# EAGLE design JiaB (EAGLE 7.2.0)
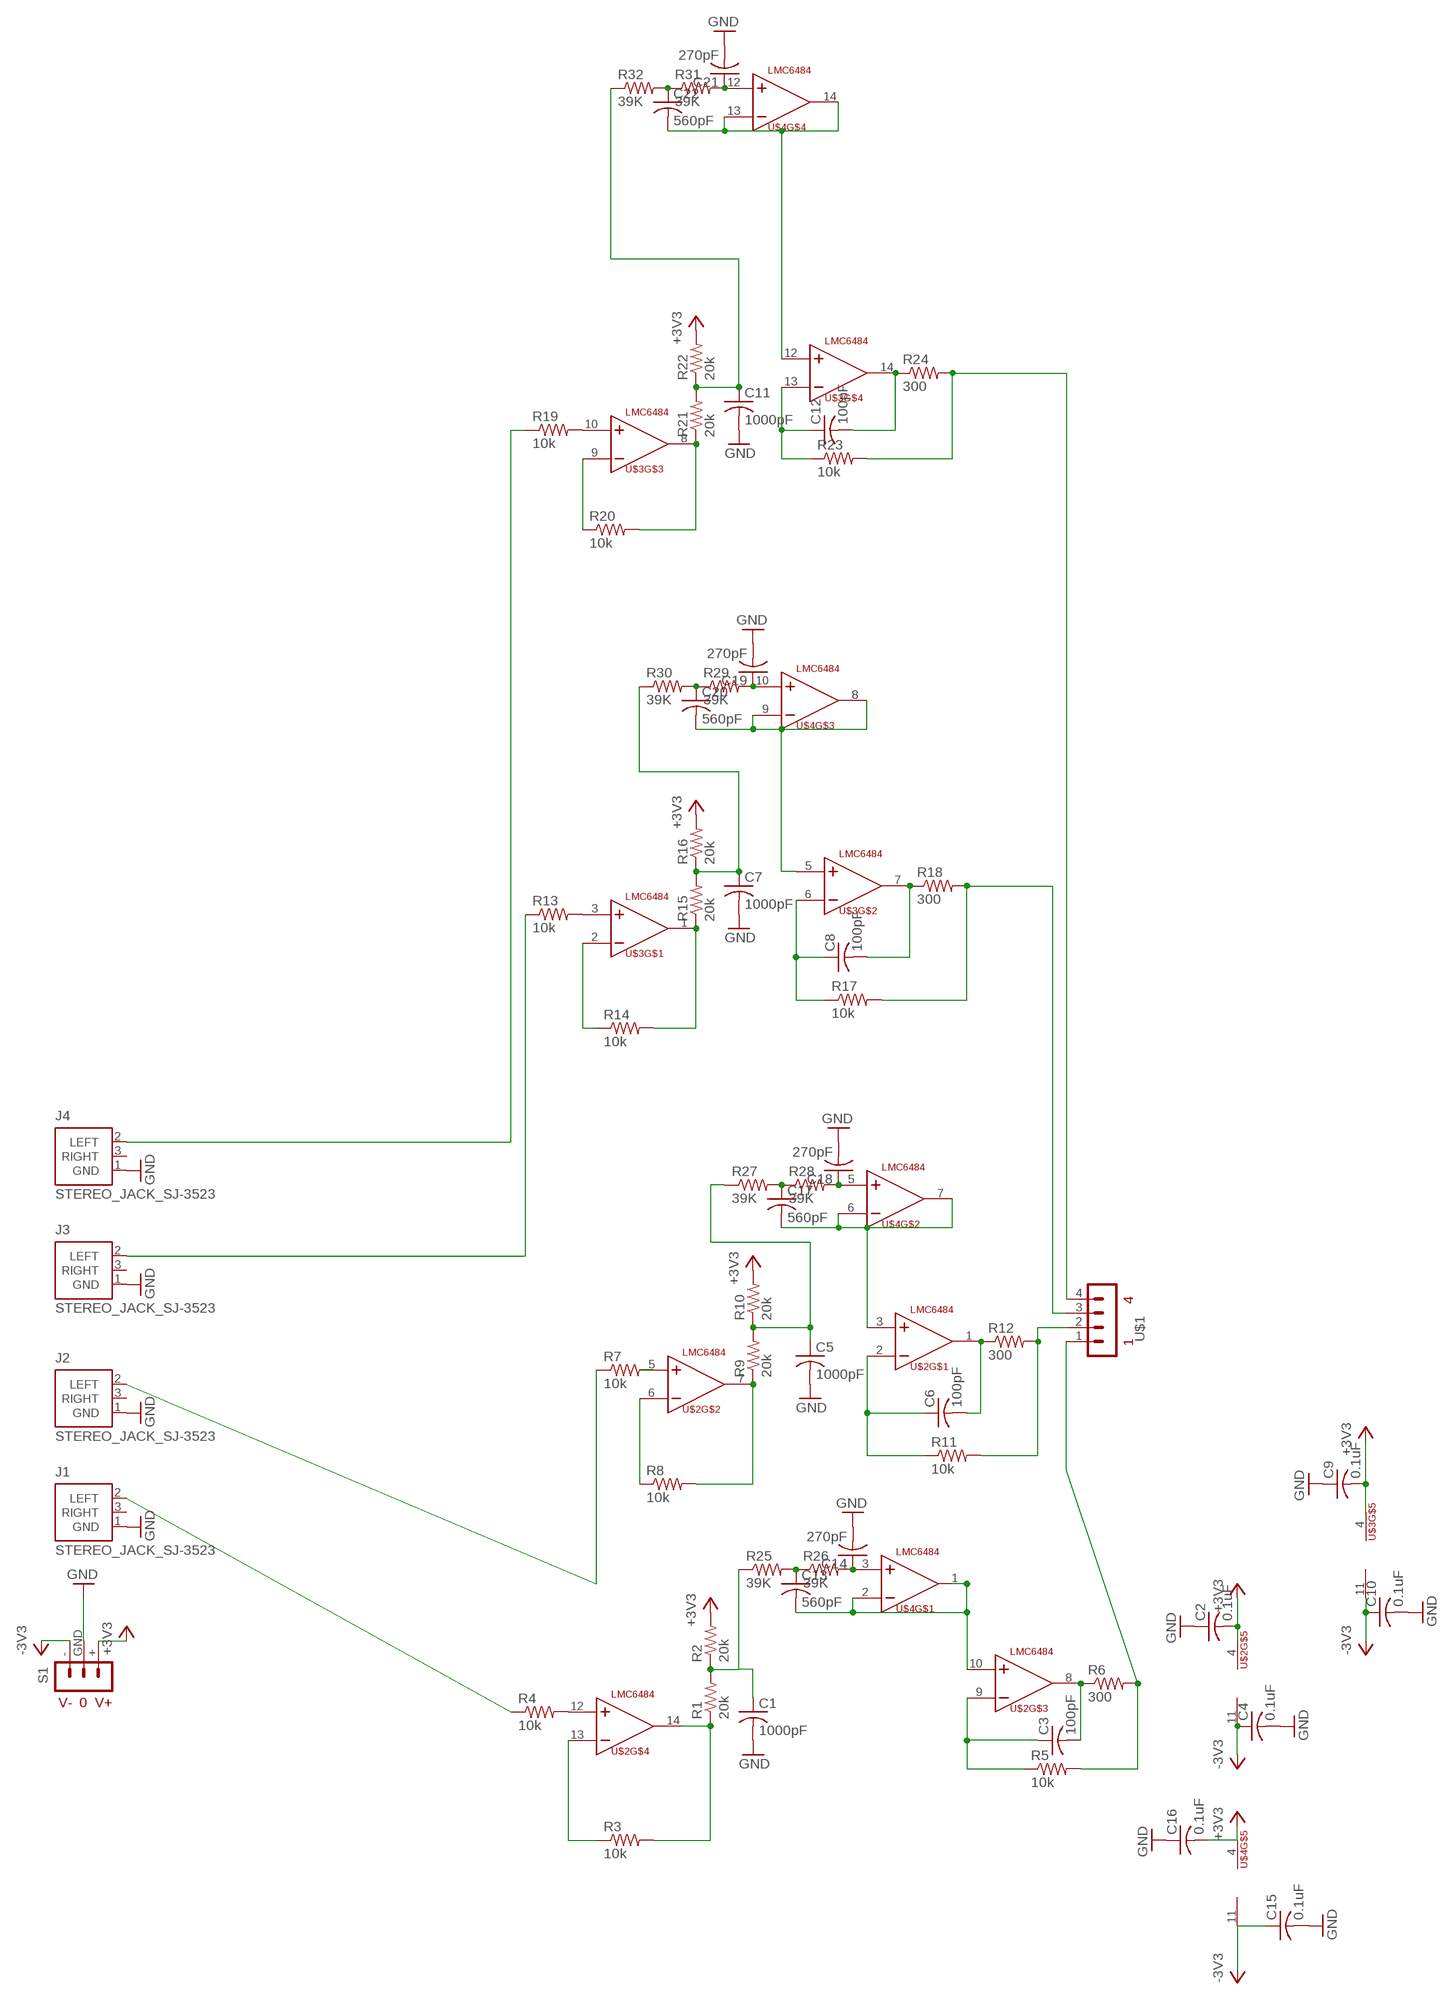
[diagram p0: schematic, sheet 1]

## Parts
C1  1000pF  C-US025-025X050  [C025-025X050]
C2  0.1uF  C-US025-025X050  [C025-025X050]
C3  100pF  C-US025-025X050  [C025-025X050]
C4  0.1uF  C-US025-025X050  [C025-025X050]
C5  1000pF  C-US025-025X050  [C025-025X050]
C6  100pF  C-US025-025X050  [C025-025X050]
C7  1000pF  C-US025-025X050  [C025-025X050]
C8  100pF  C-US025-025X050  [C025-025X050]
C9  0.1uF  C-US025-025X050  [C025-025X050]
C10  0.1uF  C-US025-025X050  [C025-025X050]
C11  1000pF  C-US025-025X050  [C025-025X050]
C12  100pF  C-US025-025X050  [C025-025X050]
C13  560pF  C-US025-025X050  [C025-025X050]
C14  270pF  C-US025-025X050  [C025-025X050]
C15  0.1uF  C-US025-025X050  [C025-025X050]
C16  0.1uF  C-US025-025X050  [C025-025X050]
C17  560pF  C-US025-025X050  [C025-025X050]
C18  270pF  C-US025-025X050  [C025-025X050]
C19  270pF  C-US025-025X050  [C025-025X050]
C20  560pF  C-US025-025X050  [C025-025X050]
C21  270pF  C-US025-025X050  [C025-025X050]
C22  560pF  C-US025-025X050  [C025-025X050]
J1  STEREO_JACK_SJ-3523  [SJ-3523]
J2  STEREO_JACK_SJ-3523  [SJ-3523]
J3  STEREO_JACK_SJ-3523  [SJ-3523]
J4  STEREO_JACK_SJ-3523  [SJ-3523]
R1  20k  R-US_0204/7  [0204/7]
R2  20k  R-US_0204/7  [0204/7]
R3  10k  R-US_0204/7  [0204/7]
R4  10k  R-US_0204/7  [0204/7]
R5  10k  R-US_0204/7  [0204/7]
R6  300  R-US_0204/7  [0204/7]
R7  10k  R-US_0204/7  [0204/7]
R8  10k  R-US_0204/7  [0204/7]
R9  20k  R-US_0204/7  [0204/7]
R10  20k  R-US_0204/7  [0204/7]
R11  10k  R-US_0204/7  [0204/7]
R12  300  R-US_0204/7  [0204/7]
R13  10k  R-US_0204/7  [0204/7]
R14  10k  R-US_0204/7  [0204/7]
R15  20k  R-US_0204/7  [0204/7]
R16  20k  R-US_0204/7  [0204/7]
R17  10k  R-US_0204/7  [0204/7]
R18  300  R-US_0204/7  [0204/7]
R19  10k  R-US_0204/7  [0204/7]
R20  10k  R-US_0204/7  [0204/7]
R21  20k  R-US_0204/7  [0204/7]
R22  20k  R-US_0204/7  [0204/7]
R23  10k  R-US_0204/7  [0204/7]
R24  300  R-US_0204/7  [0204/7]
R25  39K  R-US_0204/7  [0204/7]
R26  39K  R-US_0204/7  [0204/7]
R27  39K  R-US_0204/7  [0204/7]
R28  39K  R-US_0204/7  [0204/7]
R29  39K  R-US_0204/7  [0204/7]
R30  39K  R-US_0204/7  [0204/7]
R31  39K  R-US_0204/7  [0204/7]
R32  39K  R-US_0204/7  [0204/7]
S1  TERMINAL_BLOCK_3_+/-3.3V  [TERMINAL_BLOCK_3.5MM_3]
U$1  TERMINAL-BLOCK-4  [TERMINAL-BLOCK-4]
U$2  LMC6484  [DIL14]
U$3  LMC6484  [DIL14]
U$4  LMC6484  [DIL14]

## Nets
+3V3: C2.2 C9.2 C16.2 R2.2 R10.2 R16.2 R22.2 S1.+ U$2.4(VCC+) U$3.4(VCC+) U$4.4(VCC+)
-3V3: C4.1 C10.1 C15.1 S1.- U$2.11(VCC-) U$3.11(VCC-) U$4.11(VCC-)
GND: C1.2 C2.1 C4.2 C5.2 C7.2 C9.1 C10.2 C11.2 C14.2 C15.2 C16.1 C18.2 C19.2 C21.2 J1.1(GND) J2.1(GND) J3.1(GND) J4.1(GND) S1.GND
N$1: J1.2(LEFT) R4.1
N$2: J2.2(LEFT) R7.1
N$3: J3.2(LEFT) R13.1
N$4: J4.2(LEFT) R19.1
N$5: R1.1 R3.2 U$2.14(OUT)
N$6: C1.1 R1.2 R2.1 R25.1
N$7: R4.2 U$2.12(IN+)
N$8: C3.2 R6.1 U$2.8(OUT)
N$9: R3.1 U$2.13(IN-)
N$10: R7.2 U$2.5(IN+)
N$11: R5.2 R6.2 U$1.1
N$12: R8.2 R9.1 U$2.7(OUT)
N$13: C3.1 R5.1 U$2.9(IN-)
N$14: C5.1 R9.2 R10.1 R27.1
N$15: C6.2 R12.1 U$2.1(OUT)
N$16: R8.1 U$2.6(IN-)
N$17: C6.1 R11.1 U$2.2(IN-)
N$18: R11.2 R12.2 U$1.2
N$19: R13.2 U$3.3(IN+)
N$20: R14.2 R15.1 U$3.1(OUT)
N$21: C7.1 R15.2 R16.1 R30.1
N$22: C8.2 R18.1 U$3.7(OUT)
N$23: R14.1 U$3.2(IN-)
N$24: C8.1 R17.1 U$3.6(IN-)
N$25: R17.2 R18.2 U$1.3
N$26: R19.2 U$3.10(IN+)
N$27: R20.2 R21.1 U$3.8(OUT)
N$28: C11.1 R21.2 R22.1 R32.1
N$29: C12.2 R24.1 U$3.14(OUT)
N$30: R20.1 U$3.9(IN-)
N$31: C12.1 R23.1 U$3.13(IN-)
N$32: R23.2 R24.2 U$1.4
N$33: C14.1 R26.2 U$4.3(IN+)
N$34: C13.2 U$2.10(IN+) U$4.1(OUT) U$4.2(IN-)
N$35: C18.1 R28.2 U$4.5(IN+)
N$36: C13.1 R25.2 R26.1
N$37: C17.1 R27.2 R28.1
N$38: C17.2 U$2.3(IN+) U$4.6(IN-) U$4.7(OUT)
N$39: C19.1 R29.2 U$4.10(IN+)
N$40: C20.1 R29.1 R30.2
N$41: C20.2 U$3.5(IN+) U$4.8(OUT) U$4.9(IN-)
N$42: C21.1 R31.2 U$4.12(IN+)
N$43: C22.1 R31.1 R32.2
N$44: C22.2 U$3.12(IN+) U$4.13(IN-) U$4.14(OUT)
Unconnected: J1.3(RIGHT) J2.3(RIGHT) J3.3(RIGHT) J4.3(RIGHT)

## Library data of the parts
C1-C12 C15 C16 = resistor:C-US: CAPACITOR, American symbol
C13 C14 C17-C22 = rcl:C-US: CAPACITOR, American symbol
J1-J4 = RHD2000_eval_board:STEREO_JACK: CUI Inc. SJ-3523 stereo audio jack
R1-R24 = resistor:R-US_: RESISTOR, American symbol
R25-R32 = rcl:R-US_: RESISTOR, American symbol
S1 = RHD2000_eval_board:TERMINAL_BLOCK_3: 3-point terminal block
U$1 = kjbrown:TERMINAL-BLOCK-4
U$2-U$4 = kjbrown:LMC6484: texas instruments quad channel op amp LMC6484

## Board
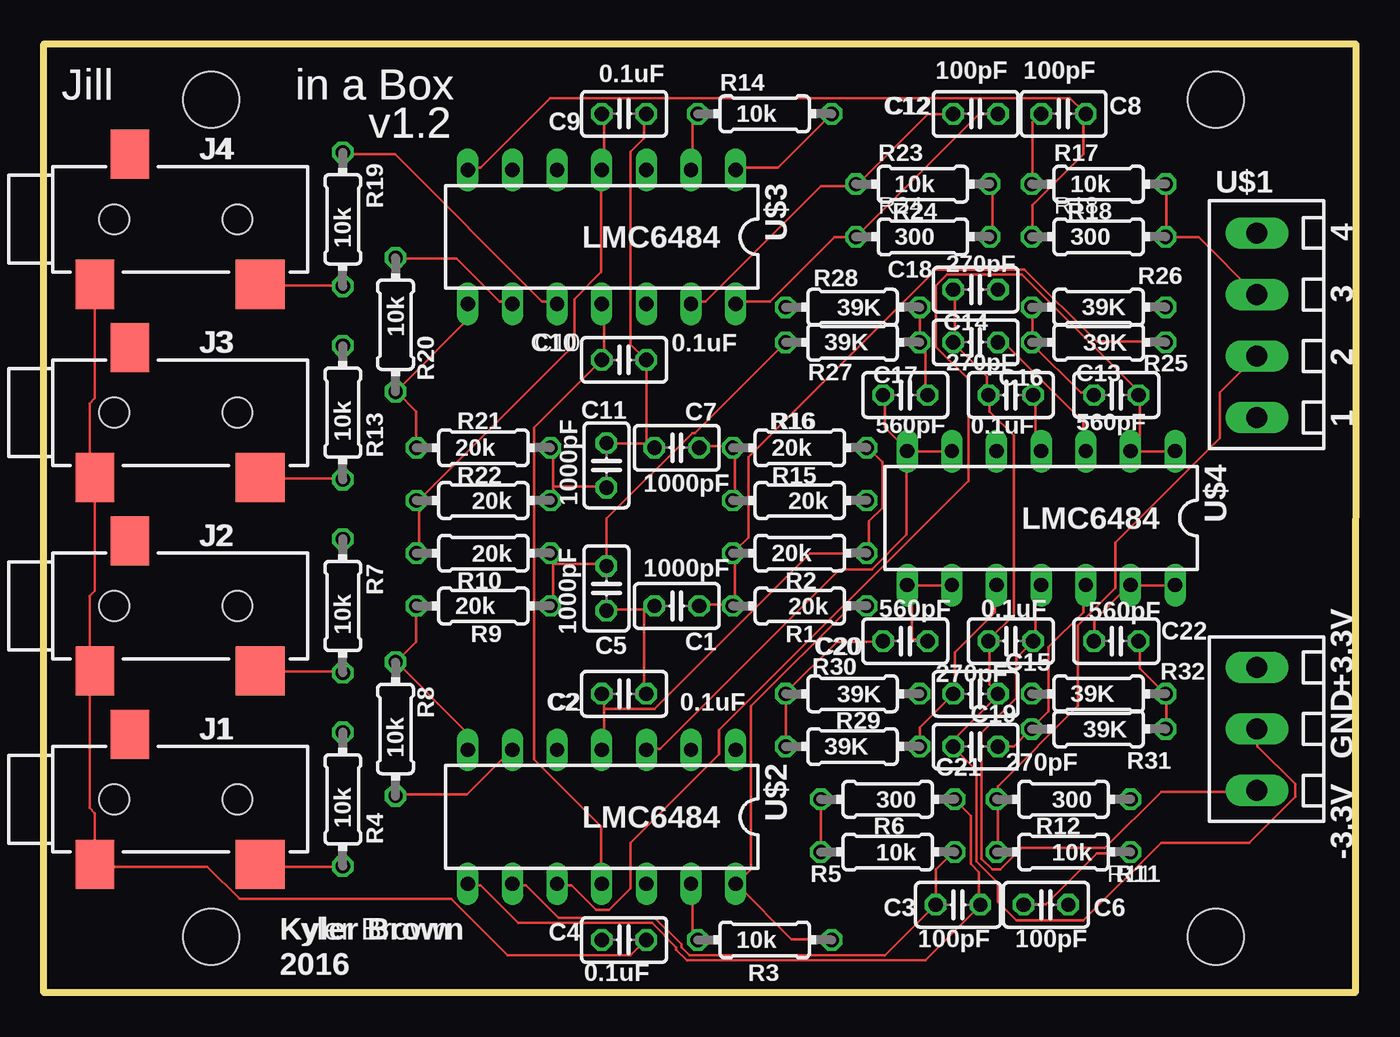
[diagram p1: board, top side]
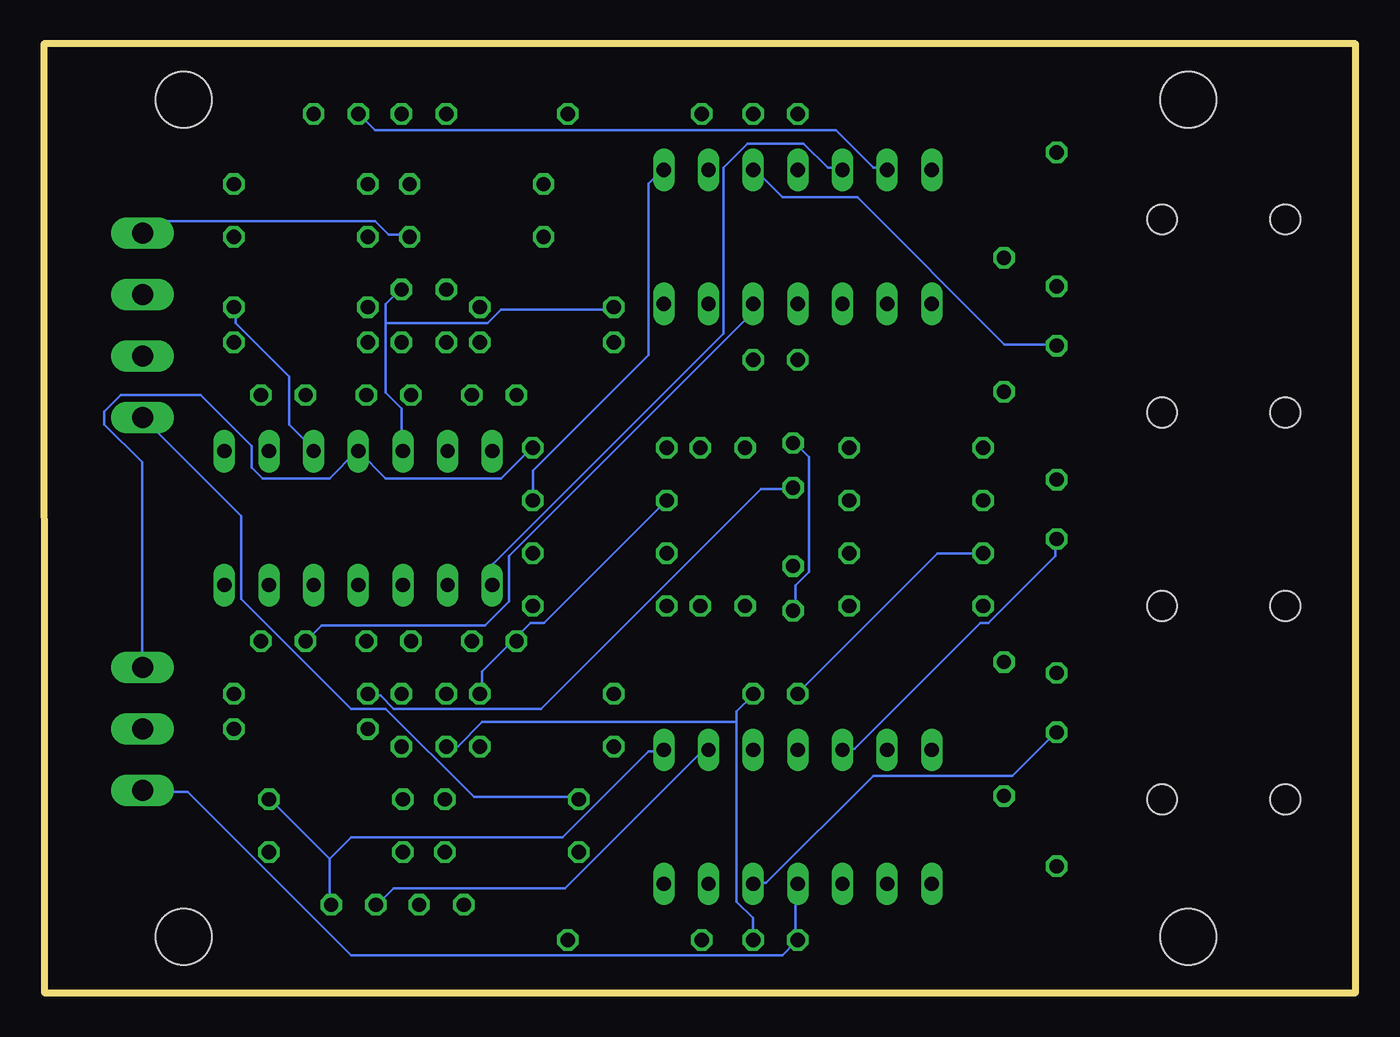
[diagram p2: board, bottom side, seen from below]

Size 74.61 x 53.98 mm. Coordinates in mm from the lower left corner, seen from the top.
Outline: 0,0 0,53.98 74.61,53.98 74.59,0 0,0
Copper layers (1*16): Top 0.0356mm / dielectric 1.5011mm / Bottom 0.0356mm
Design rules "LaenPCBOrder": minimum track width 6mil, minimum drill 13mil, track to track 6mil, track to pad 6mil, pad to pad 6mil, via to via 6mil, smd to smd 6mil, copper to edge 15mil, drill to drill 6mil, minimum pad ring 7mil, minimum via ring 7mil, stop-mask expansion 3mil, vias tented up to drill 0mil, thermal gap 10mil
Holes 3.2 mm at 9.53,3.17 9.53,50.8 66.67,50.8 66.67,3.17

### Footprints (pad centres in the part's own frame; a part is rotated, then mirrored left to right if it is on the bottom)
C025-025X050 = drill 0.813 octagon: 1 -1.27,0; 2 1.27,0
SJ-3523 = smd 2.2 x 2.8: 1 -1.1,-3.7; 3 0.9,3.7 | smd 2.8 x 2.8: 2 8.3,-3.7 | hole 1.7: 7,0; 0,0
0204/7 = drill 0.813 octagon: 1 -3.81,0; 2 3.81,0
TERMINAL_BLOCK_3.5MM_3 = drill 1.2 long: + 3.5,0; - -3.5,0; GND 0,0
TERMINAL-BLOCK-4 = drill 1.2 long: 1 -12.28,0; 2 -8.78,0; 3 -5.28,0; 4 -1.78,0
DIL14 = drill 0.813 long: 1 -6.35,-3.81; 2 -3.81,-3.81; 3 -1.27,-3.81; 4 1.27,-3.81; 5 3.81,-3.81; 6 6.35,-3.81; 7 8.89,-3.81; 8 8.89,3.81; 9 6.35,3.81; 10 3.81,3.81; 11 1.27,3.81; 12 -1.27,3.81; 13 -3.81,3.81; 14 -6.35,3.81

### Placement (x,y rotation side)
C1  36,22 180 top
C2  33,17 180 top
C3  52,5 0 top
C4  33,3 0 top
C5  32,23 270 top
C6  57,5 0 top
C7  36,31 180 top
C8  58,50 0 top
C9  33,50 180 top
C10  33,36 0 top
C11  32,30 90 top
C12  53,50 0 top
C13  61,34 0 top
C14  53,37 180 top
C15  55,20 180 top
C16  55,34 0 top
C17  49,34 180 top
C18  53,40 180 top
C19  53,17 0 top
C20  49,20 0 top
C21  53,14 180 top
C22  61,20 180 top
J1  4,11 0 top
J2  4,22 0 top
J3  4,33 0 top
J4  4,44 0 top
R1  43,22 180 top
R2  43,25 0 top
R3  41,3 0 top
R4  17,11 90 top
R5  48,8 180 top
R6  48,11 180 top
R7  17,22 90 top
R8  20,15 90 top
R9  25,22 0 top
R10  25,25 180 top
R11  58,8 180 top
R12  58,11 180 top
R13  17,33 90 top
R14  41,50 0 top
R15  43,28 180 top
R16  43,31 0 top
R17  60,46 0 top
R18  60,43 0 top
R19  17,44 90 top
R20  20,38 270 top
R21  25,31 0 top
R22  25,28 180 top
R23  50,46 0 top
R24  50,43 0 top
R25  60,37 180 top
R26  60,39 0 top
R27  46,37 0 top
R28  46,39 180 top
R29  46,14 0 top
R30  46,17 180 top
R31  60,15 180 top
R32  60,17 0 top
S1  69,15 90 top
U$1  69,45 90 top
U$2  33,10 180 top
U$3  33,43 180 top
U$4  58,27 180 top

### Tracks (layer width: path | path; a pad name or v marks a point on that pad's centre or on a via)
+3V3
  Top 0.152: R16.2 46.94,30.94 47.7,30.18 47.7,27.58 46.94,26.82 46.94,25.15 R2.2 46.79,24.99 43.59,24.99 34.75,16.15 31.85,16.15 | C16.2 56.39,33.98 56.39,31.24 56.69,30.94 U$4.4 | C9.2 31.85,49.99 31.85,46.94 U$3.4 31.7,46.79 31.7,41 30.18,39.47 30.18,36.88 21.34,28.04 R22.2 21.34,27.89 21.34,25.15 R10.2 | 31.85,16.15 31.85,16.92 C2.2 | 31.85,16.15 31.85,13.87 U$2.4
  Bottom 0.152: S1.+ 69.04,18.59 69.04,30.18 71.17,32.31 71.17,33.07 70.26,33.98 65.68,33.98 62.79,31.09 62.79,29.87 62.18,29.26 58.37,29.26 56.84,30.79 U$4.4 56.69,30.79 55.17,29.26 48.62,29.26 46.94,30.94 R16.2 | R10.2 21.34,24.99 23.77,24.99 31.7,17.07 C2.2
-3V3
  Top 0.152: U$4.11 56.69,23.16 56.39,22.86 56.39,20.12 C15.1 56.24,19.96 55.32,19.05 55.32,16.76 53.34,14.78 53.34,7.62 53.95,7.01 54.41,7.01 55.63,8.23 60.35,8.23 63.55,11.43 68.89,11.43 S1.- | U$3.11 31.85,39.17 31.85,36.12 C10.1 31.7,35.97 27.89,32.16 27.89,13.26 31.7,9.45 31.7,6.25 U$2.11
  Bottom 0.152: U$2.11 31.85,6.1 31.85,3.05 C4.1 31.85,2.9 32.61,2.13 57.15,2.13 66.45,11.43 68.89,11.43 S1.-
GND
  Top 0.152: C18.2 51.82,39.93 51.82,37.03 C14.2 51.82,36.88 53.65,35.05 53.65,34.14 C16.1 53.8,33.98 53.8,33.07 55.17,31.7 55.17,21.49 53.8,20.12 C15.2 53.8,19.96 53.8,17.53 54.25,17.07 C19.2 54.25,16.92 51.82,14.48 51.82,14.02 C21.2 51.82,13.87 53.03,12.65 53.03,7.47 54.25,6.25 54.25,5.18 55.32,4.12 59.13,4.12 63.55,8.53 68.58,8.53 71.17,11.12 71.17,11.89 69.04,14.02 69.04,14.94 S1.GND | J4.1 2.9,40.23 2.9,33.83 2.59,33.53 2.59,29.72 2.9,29.41 J3.1 2.9,29.26 2.9,22.86 2.59,22.55 2.59,18.75 2.9,18.44 J2.1 2.9,18.29 2.59,17.98 2.59,10.52 2.9,10.21 2.9,7.32 J1.1 3.05,7.16 9.3,7.16 11.12,5.33 23.16,5.33 26.36,2.13 33.38,2.13 34.14,2.9 C4.2 | 34.14,21.79 34.44,21.79 34.59,21.95 C1.2 34.14,21.79 | 34.14,21.79 32,21.79 C5.2 | 34.14,21.79 34.14,17.07 C2.1 | 34.29,31.24 34.44,31.24 34.59,31.09 C7.2 34.29,31.24 | 34.29,31.24 32,31.24 C11.2 | 34.29,31.24 34.29,35.97 C10.2 34.14,36.12 33.38,36.88 33.38,47.85 34.14,48.62 34.14,49.99 C9.1
  Bottom 0.152: 35.2,15.39 35.2,16 34.29,16.92 C2.1 | 35.2,15.39 35.2,5.18 34.29,4.27 34.29,3.05 C4.2 | C5.2 31.85,21.79 31.85,23.16 31.09,23.93 31.09,30.48 31.85,31.24 C11.2 | 35.2,15.39 49.68,15.39 51.05,14.02 51.66,14.02 C21.2
N$1
  Top 0.152: R4.1 16.92,7.16 12.34,7.16 J1.2
N$2
  Top 0.152: R7.1 16.92,18.29 12.34,18.29 J2.2
N$3
  Top 0.152: R13.1 16.92,29.26 12.34,29.26 J3.2
N$4
  Top 0.152: R19.1 16.92,40.23 12.34,40.23 J4.2
N$5
  Top 0.152: R3.2 44.81,3.05 42.52,3.05 39.47,6.1 U$2.14 39.47,6.25 40.23,7.01 40.23,16.31 45.87,21.95 46.79,21.95 R1.1
N$6
  Top 0.152: C1.1 37.34,22.1 39.17,22.1 R1.2 39.32,22.1 39.32,24.99 R2.1 39.32,25.15 40.08,25.91 40.08,30.48 50.75,41.15 55.78,41.15 59.89,37.03 63.7,37.03 R25.1
N$7
  Bottom 0.152: U$2.12 34.14,6.25 33.53,6.25 27.43,12.34 19.51,12.34 17.07,14.78 R4.2
N$8
  Top 0.152: R6.1 51.82,10.97 52.73,10.06 52.73,7.32 53.19,6.86 53.19,5.03 C3.2 53.19,4.88 50.14,1.83 36.58,1.83 35.97,2.44 35.97,2.59 34.59,3.96 26.98,3.96 24.84,6.1 24.23,6.1 U$2.8
N$9
  Top 0.152: U$2.13 36.88,6.1 36.88,3.35 37.19,3.05 R3.1
N$10
  Bottom 0.152: U$2.5 29.11,13.87 28.5,13.87 21.34,21.03 20.88,21.03 17.07,24.84 17.07,25.76 R7.2
N$11
  Top 0.152: R5.2 44.2,8.08 44.2,10.97 R6.2
  Bottom 0.152: R6.2 44.2,11.12 50.14,11.12 55.17,16.15 57.15,16.15 63.4,22.4 63.4,27.13 68.89,32.61 U$1.1
N$12
  Top 0.152: U$2.7 24.08,13.87 24.08,14.78 20.12,18.75 R8.2 20.12,18.9 21.18,19.96 21.18,21.95 R9.1
N$13
  Top 0.152: R5.1 51.66,7.92 50.75,7.01 50.75,5.03 C3.1 50.6,4.88 47.85,2.13 36.73,2.13 36.27,2.59 36.27,2.74 34.75,4.27 29.26,4.27 27.43,6.1 26.67,6.1 U$2.9
N$14
  Top 0.152: 28.96,24.38 28.96,24.99 R10.1 | 28.96,24.38 28.96,22.1 R9.2 | 28.96,24.38 31.85,24.38 C5.1 32,24.38 32,26.98 36.88,31.85 37.03,31.85 42.06,36.88 R27.1
N$15
  Bottom 0.152: 58.37,7.62 58.37,5.03 C6.2 | 58.37,7.62 61.72,10.97 R12.1 | 58.37,7.62 57.15,8.84 45.11,8.84 40.23,13.72 39.47,13.72 U$2.1
N$16
  Top 0.152: R8.1 20.12,11.28 24.08,11.28 26.52,13.72 U$2.6
N$17
  Top 0.152: C6.1 55.78,5.03 57,5.03 59.89,7.92 61.72,7.92 R11.1
  Bottom 0.152: U$2.2 36.88,13.72 37.19,13.72 44.96,5.94 54.71,5.94 55.63,5.03 C6.1
N$18
  Top 0.152: R11.2 54.25,8.08 54.25,10.97 R12.2 54.25,11.12 54.25,11.73 58.83,16.31 58.83,20.88 60.96,23.01 60.96,25.6 66.9,31.55 66.9,34.14 68.89,36.12 U$1.2
N$19
  Bottom 0.152: R13.2 17.07,36.88 19.96,36.88 28.35,45.26 32.61,45.26 34.14,46.79 U$3.3
N$20
  Top 0.152: U$3.1 39.47,46.94 41.76,46.94 44.81,49.99 R14.2
  Bottom 0.152: R15.1 46.79,28.04 46.79,29.72 40.23,36.27 40.23,46.02 39.47,46.79 U$3.1
N$21
  Top 0.152: C7.1 37.34,31.09 39.17,31.09 R16.1 39.32,30.94 39.32,28.04 R15.2
  Bottom 0.152: R30.1 49.68,17.07 49.68,18.29 46.94,21.03 46.18,21.03 39.32,27.89 R15.2
N$22
  Top 0.152: R18.1 56.24,43.13 56.24,44.81 59.13,47.7 59.13,49.99 C8.2 59.13,50.14 58.37,50.9 28.8,50.9 24.84,46.94 24.23,46.94 U$3.7
N$23
  Top 0.152: U$3.2 36.88,46.94 36.88,49.68 37.19,49.99 R14.1
N$24
  Top 0.152: R17.1 56.24,46.02 56.24,49.53 56.69,49.99 C8.1
  Bottom 0.152: U$3.6 26.67,46.94 27.43,46.94 29.57,49.07 55.78,49.07 56.69,49.99 C8.1
N$25
  Top 0.152: R17.2 63.86,45.87 63.86,43.13 R18.2 63.86,42.98 65.68,42.98 68.89,39.78 U$1.3
N$26
  Top 0.152: U$3.10 29.11,39.32 28.35,39.32 19.96,47.7 17.07,47.7 R19.2
N$27
  Top 0.152: R21.1 21.18,31.09 21.18,33.07 20.12,34.14 R20.2 20.12,34.29 24.08,38.25 24.08,39.17 U$3.8
N$28
  Top 0.152: 28.96,28.8 28.96,30.94 R21.2 | 28.96,28.8 28.96,28.04 R22.1 | 28.96,28.8 31.85,28.8 C11.1
  Bottom 0.152: R32.1 56.08,16.92 55.47,16.92 54.71,16.15 46.33,16.15 33.83,28.65 32,28.65 C11.1
N$29
  Top 0.152: U$3.14 39.47,39.32 41.3,39.32 44.96,42.98 46.18,42.98 R24.1 46.33,43.13 53.19,49.99 54.25,49.99 C12.2
N$30
  Top 0.152: U$3.9 26.52,39.32 25.91,39.32 23.47,41.76 20.12,41.76 R20.1
N$31
  Top 0.152: U$3.13 36.88,39.32 37.64,39.32 44.2,45.87 46.18,45.87 R23.1 46.33,46.02 50.29,49.99 51.66,49.99 C12.1
N$32
  Top 0.152: R24.2 53.95,43.13 53.95,45.87 R23.2
  Bottom 0.152: R24.2 53.95,43.13 55.02,43.13 55.78,43.89 68.28,43.89 68.89,43.28 U$1.4
N$33
  Top 0.152: 54.41,37.03 C14.1 54.41,36.88 54.71,36.88 59.13,32.46 59.13,30.94 U$4.3
  Bottom 0.152: R26.2 63.7,38.86 63.7,38.1 60.66,35.05 60.66,32.31 59.28,30.94 U$4.3
N$34
  Top 0.152: 62.33,30.79 64.31,30.79 U$4.1 | 62.33,30.79 61.87,30.79 U$4.2 62.33,30.79 | U$2.10 29.26,6.1 30.02,6.1 31.39,4.72 32.16,4.72 33.38,5.94 33.38,8.53 38.41,13.56 38.41,14.94 52.58,29.11 52.58,34.9 50.75,36.73 50.75,40.23 51.36,40.84 55.63,40.84 62.33,34.14 C13.2 62.33,33.98 62.33,30.79
N$35
  Top 0.152: 54.41,40.08 C18.1
  Bottom 0.152: 55.17,38.1 55.17,39.17 54.41,39.93 C18.1 | 55.17,38.1 55.17,34.14 54.25,33.22 54.25,30.94 U$4.5 | 55.17,38.1 49.38,38.1 48.62,38.86 42.22,38.86 R28.2
N$36
  Top 0.152: 59.74,33.98 C13.1 59.59,34.14 58.98,34.14 56.24,36.88 R25.2 56.24,37.03 56.24,38.86 R26.1
N$37
  Top 0.152: 50.29,33.98 C17.1 50.14,34.14 50.14,36.58 49.84,36.88 R27.2 49.84,37.03 49.84,38.86 R28.1
N$38
  Top 0.152: U$2.3 34.29,13.87 35.05,13.87 45.26,24.08 47.09,24.08 49.07,26.06 49.07,30.79 U$4.7 | C17.2 47.85,33.98 47.85,32.16 49.07,30.94 U$4.7 | U$4.6 51.51,30.79 49.23,30.79 U$4.7
N$39
  Top 0.152: R29.2 49.84,14.02 49.84,15.09 51.66,16.92 C19.1 51.82,17.07 51.82,19.36 54.1,21.64 54.1,23.16 U$4.10
N$40
  Top 0.152: 46.79,19.96 C20.1 46.63,19.96 45.11,19.96 42.22,17.07 R30.2 42.22,16.92 42.22,14.02 R29.1
N$41
  Top 0.152: 49.38,23.16 51.51,23.16 U$4.9 | 49.38,23.16 49.23,23.16 U$4.8 49.38,23.16 | 49.38,23.16 49.38,20.12 C20.2
  Bottom 0.152: U$3.5 29.26,46.94 30.02,46.94 31.39,48.31 34.59,48.31 35.97,46.94 35.97,37.49 49.07,24.38 49.07,23.32 U$4.8
N$42
  Top 0.152: C21.1 54.41,14.02 55.17,14.02 56.08,14.94 R31.2 56.24,15.09 57.15,16 57.15,19.66 59.13,21.64 59.13,23.16 U$4.12
N$43
  Top 0.152: R31.1 63.86,15.09 63.86,16.92 R32.2 | C22.1 62.33,19.96 62.33,18.44 63.7,17.07 R32.2 | 63.86,17.07 R32.2
N$44
  Top 0.152: C22.2 59.74,20.12 59.74,21.18 61.72,23.16 U$4.13 61.87,23.16 64.31,23.16 U$4.14
  Bottom 0.152: U$3.12 34.29,39.17 34.29,38.71 48.16,24.84 48.16,22.25 49.53,20.88 58.83,20.88 59.59,20.12 C22.2

### Text on the board
tNames: Jill | in a Box | v1.2 | Kyler Brown | 2016
_tsilk: 0.1uF | 100pF | 100pF | Jill | in a Box | R14 | C9 | 10k | C12 | C8 | v1.2 | J4 | R23 | R17 | U$1 | U$3 | 10k | 10k | R19 | LMC6484 | R24 | R18 | 300 | 300 | 4 | 10k | C18 | 270pF | R28 | 10k | R26 | 39K | C14 | 39K | 3 | R20 | 39K | 39K | J3 | C10 | 0.1uF | C17 | 270pF | 2 | R27 | C16 | C13 | R25 | C11 | C7 | R21 | R16 | 560pF | 0.1uF | 560pF | 1 | 10k | 20k | 20k | R13 | R22 | R15 | U$4 | 1000pF | 20k | 1000pF | 20k | LMC6484 | J2 | 20k | 1000pF | 1000pF | 20k | R10 | R2 | R7 | 20k | 20k | 560pF | 0.1uF | 560pF | R9 | R1 | C22 | 10k | C1 | C5 | C20 | R30 | C15 | 270pF | R32 | 39K | 39K | +3.3V | R8 | C2 | 0.1uF | R29 | C19 | 39K | J1 | 39K | 270pF | R31 | 10k | U$2 | C21 | GND | LMC6484 | 300 | 300 | R6 | R12 | 10k | R4 | 10k | 10k | -3.3V | R5 | R11 | C3 | C6 | Kyler Brown | C4 | 10k | 100pF | 100pF | 2016 | 0.1uF | R3